# Altium schematic sheet AutoProgram.SchDoc
size A; SheetNumber: 6; SheetTotal: 7
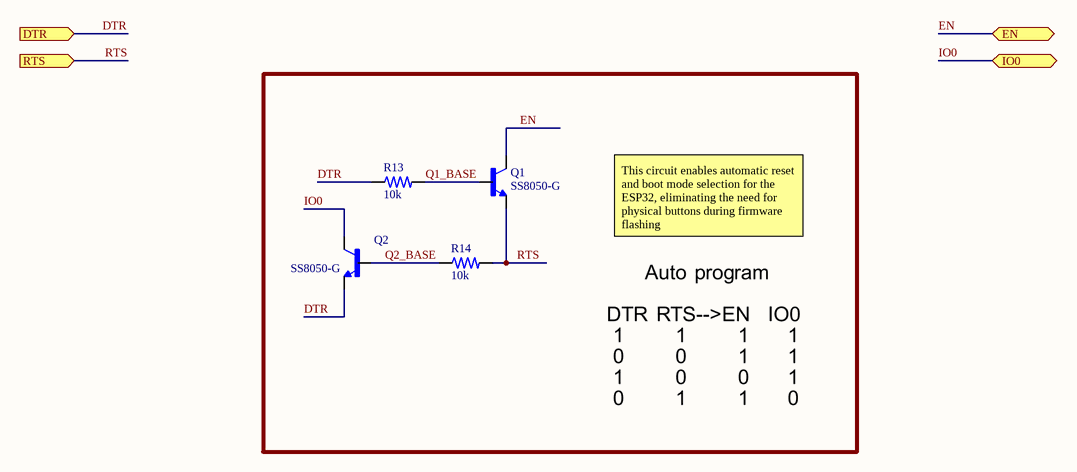
[diagram p0: AutoProgram.SchDoc]

## Parts
Q1  SS8050-G  [TRANS_SS8050-G]
Q2  SS8050-G  [TRANS_SS8050-G]
R13  10k  [0402 RES]
R14  10k  [0402 RES]

## Ports
DTR (in, see Master[2C]), EN (bidir, see Master[2C], ESP32-S3-WROOM[3C]), IO0 (bidir, see Master[2C], ESP32-S3-WROOM[3C]), RTS (in, see Master[2C])

## Nets
DTR: Q2.2(E) R13.1 ; port DTR
EN: Q1.3(C) ; port EN
IO0: Q2.3(C) ; port IO0
Q1_BASE: Q1.1(B) R13.2
Q2_BASE: Q2.1(B) R14.1
RTS: Q1.2(E) R14.2 ; port RTS

## Notes on the sheet
- This circuit enables automatic reset and boot mode selection for the ESP32, eliminating the need for physical buttons during firmware flashing

## Library data of the parts
Q1 Q2 = SS8050-G: Bipolar (BJT) Transistor NPN 25 V 1.5 A 100MHz 300 mW Surface Mount SOT-23-3; MP: SS8050G; MF: Comchip; Digi-Key_Part_Number: 641-1790-2-ND; Check_prices: https://www.snapeda.com/parts/SS8050G/Comchip/view-part/?ref=eda; Package: None; SnapEDA_Link: https://www.snapeda.com/parts/SS8050G/Comchip/view-part/?ref=snap; Value: *
R13 R14 = 0402 SMD Resistor: Res Thick Film 0402 10K Ohm 5% 0.125W(1/8W) ±200ppm/C Pad SMD T/R; Manufacturer: Yageo; Manufacturer Part Number: RC0402JR-7W10KL; Value: 10kR; ComponentLink1Description: Link; ComponentLink1URL: *; Supplier: Future Electronics; Supplier Part Number: 5143940; RoHS: Yes; Category: Chip SMD Resistors; Stock: 480000; Pricing: 10000=0.0009, 50000=0.0009, 200000=0.0009, 500000=0.0009, 1250000=0.0009 (USD); Case/Package: 343Case; Packaging: 10Packaging; RoHS Compliant: Yes; ComponentLink2URL: https://datasheet.octopart.com/RC0402JR-7W10KL-Yageo-datasheet-164759695.pdf?src-supplier=Future+Electronics; ComponentLink2Description: https://datasheet.octopart.com/RC0402JR-7W10KL-Yageo-datasheet-164759695.pdf?src-supplier=Future+Electronics